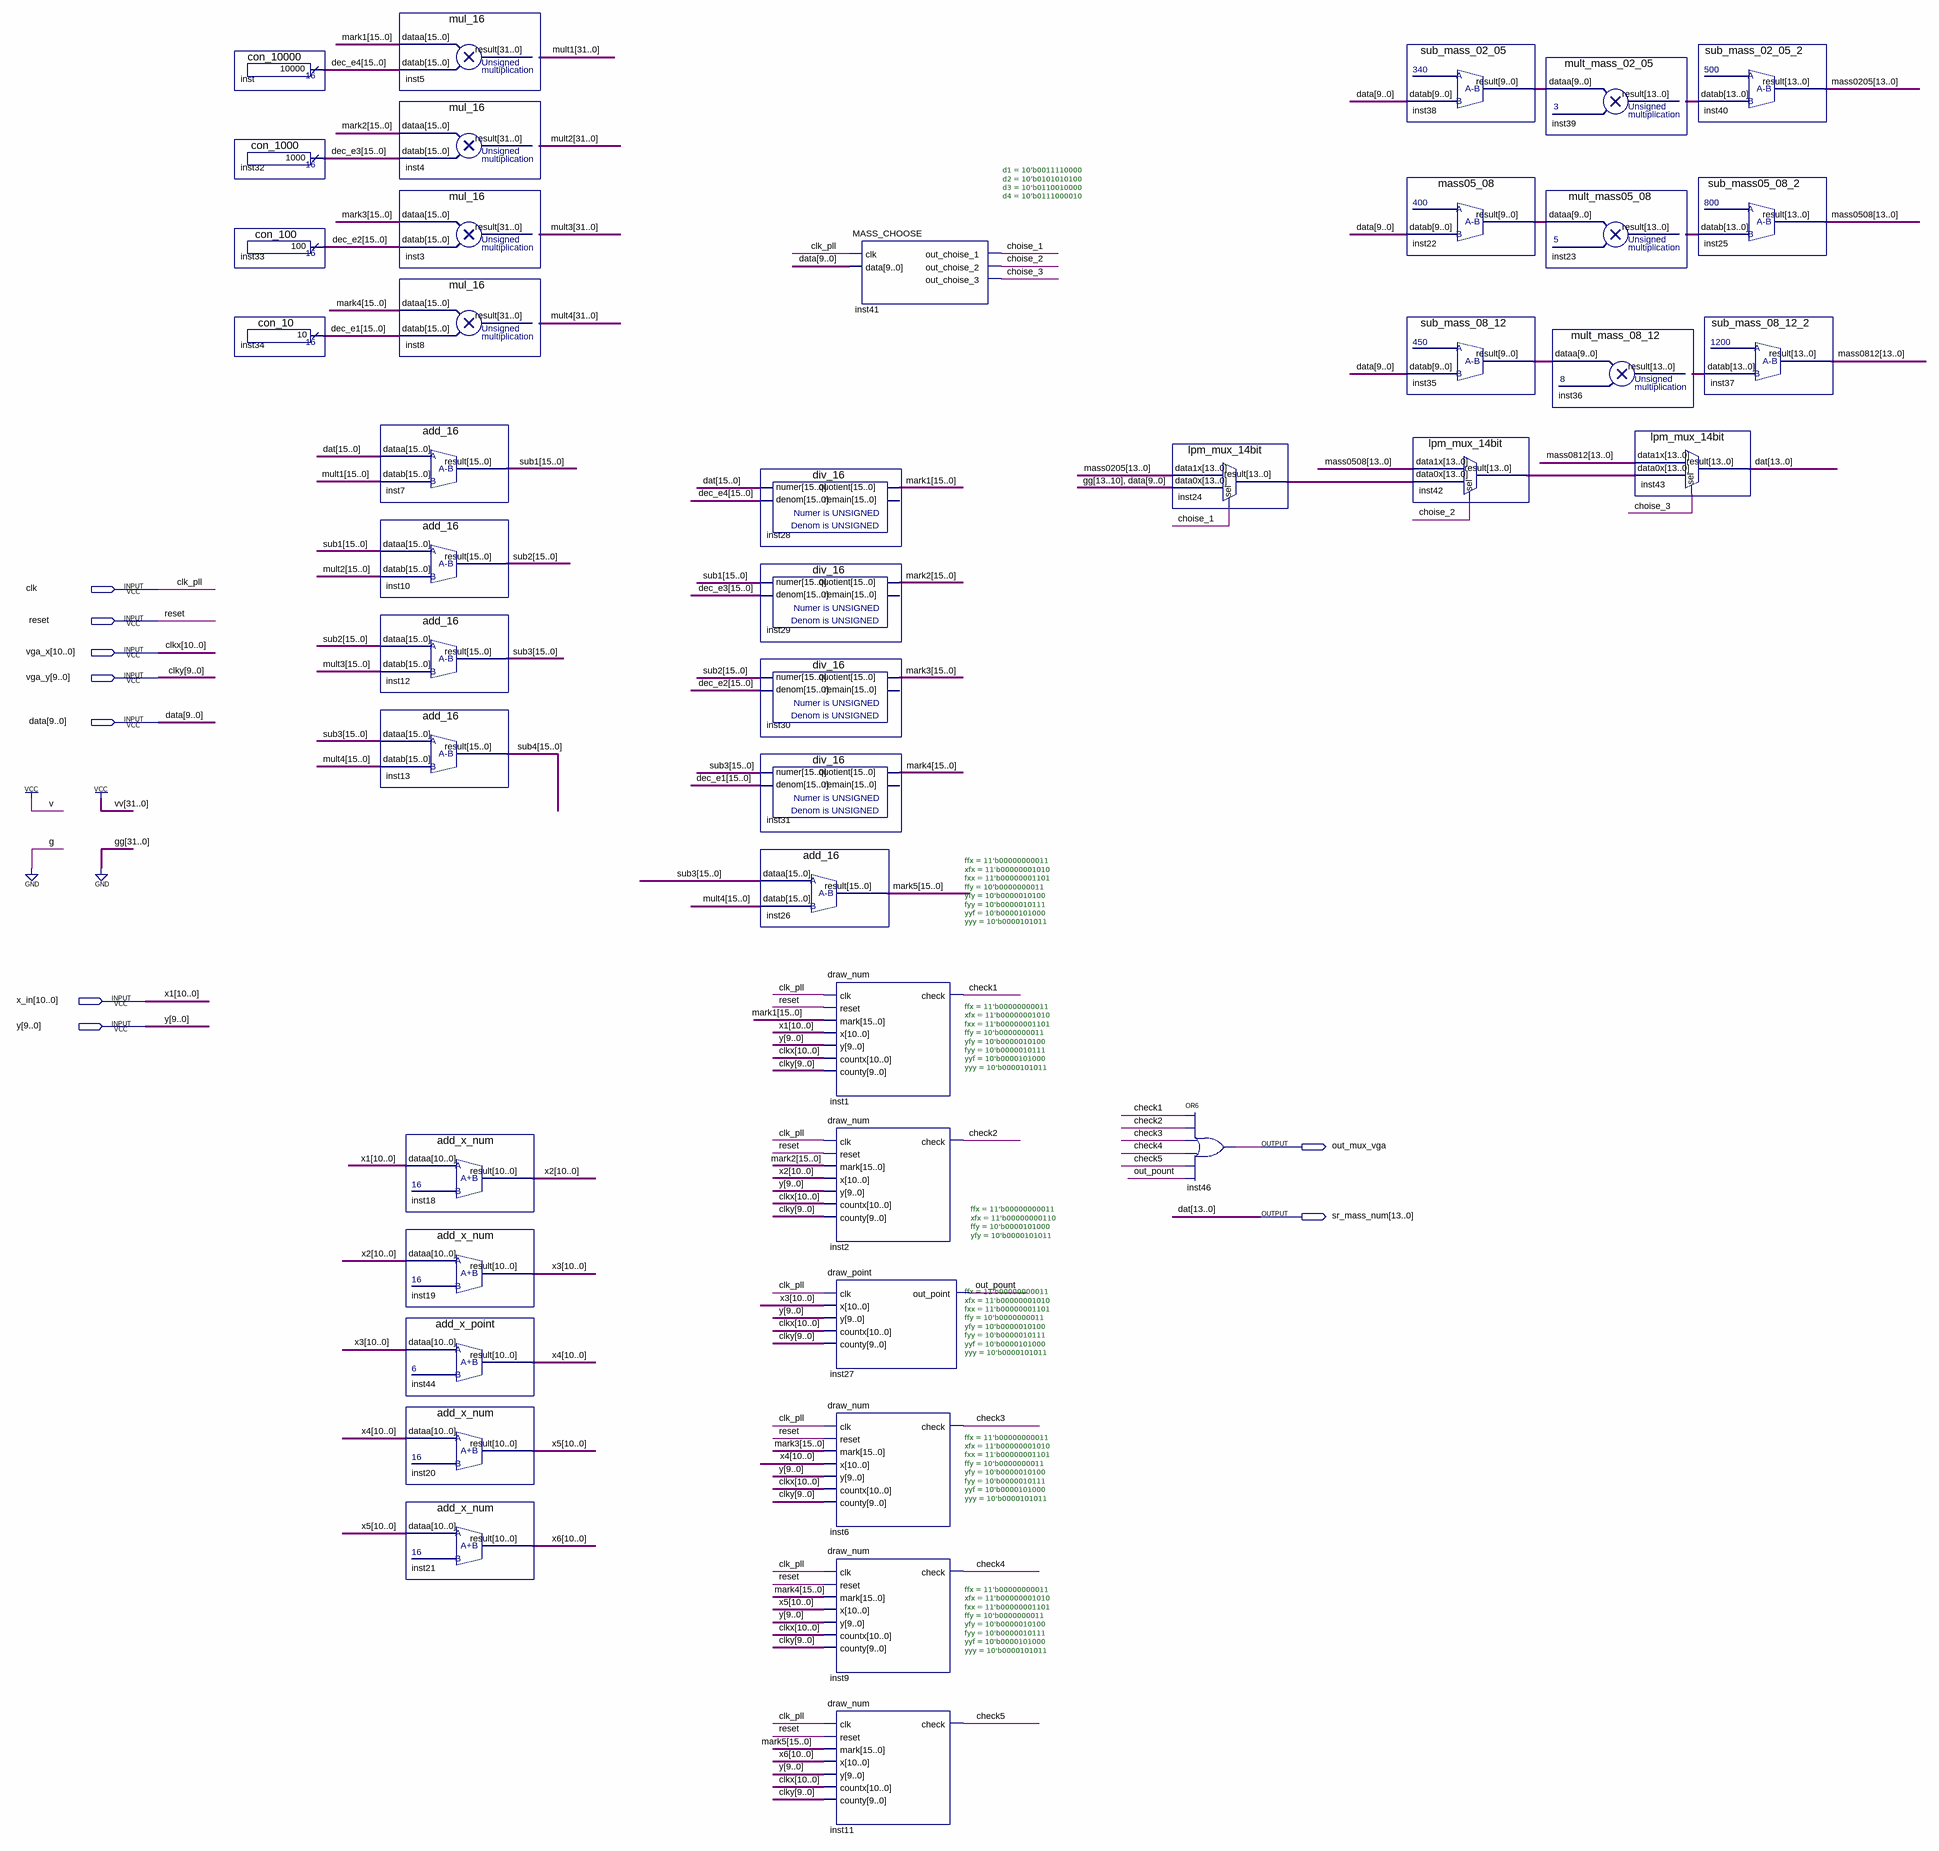
[diagram p0: schematic sheet]
// Quartus schematic sr_mass.bdf as structural Verilog: 42 symbols, 9 pins
module sr_mass (
  input  clk,
  input  reset,
  input  [10:0] vga_x,
  input  [9:0] vga_y,
  input  [9:0] data,
  input  [10:0] x_in,
  input  [9:0] y,
  output out_mux_vga,
  output [13:0] sr_mass_num
);

  wire check1, check2, check3, check4, check5, choise_1, choise_2, choise_3, out_pount;
  wire [9:0] inst22_result, inst35_result, inst38_result;
  wire [10:0] x2, x3, x4, x5, x6;
  wire [13:0] inst23_result, inst24_result, inst36_result, inst39_result, inst42_result, mass0205, mass0508,
       mass0812;
  wire [15:0] dec_e1, dec_e2, dec_e3, dec_e4, mark1, mark2, mark3, mark4, mark5, sub1, sub2, sub3, sub4;
  wire [15:14] dat;
  wire [31:0] mult1, mult2, mult3, mult4;

  con_10000 inst (.result(dec_e4));
  con_1000 inst32 (.result(dec_e3));
  con_100 inst33 (.result(dec_e2));
  con_10 inst34 (.result(dec_e1));
  mul_16 inst5 (.dataa(mark1), .datab(dec_e4), .result(mult1));
  mul_16 inst4 (.dataa(mark2), .datab(dec_e3), .result(mult2));
  mul_16 inst3 (.dataa(mark3), .datab(dec_e2), .result(mult3));
  mul_16 inst8 (.dataa(mark4), .datab(dec_e1), .result(mult4));
  add_16 inst7 (.dataa({dat, sr_mass_num}), .datab(mult1[15:0]), .result(sub1));
  add_16 inst10 (.dataa(sub1), .datab(mult2[15:0]), .result(sub2));
  add_16 inst12 (.dataa(sub2), .datab(mult3[15:0]), .result(sub3));
  add_16 inst13 (.dataa(sub3), .datab(mult4[15:0]), .result(sub4));
  add_x_num inst18 (.dataa(x_in), .result(x2));
  add_x_num inst19 (.dataa(x2), .result(x3));
  add_x_point inst44 (.dataa(x3), .result(x4));
  add_x_num inst20 (.dataa(x4), .result(x5));
  add_x_num inst21 (.dataa(x5), .result(x6));
  div_16 inst28 (.numer({dat, sr_mass_num}), .denom(dec_e4), .quotient(mark1));  // open: remain
  div_16 inst29 (.numer(sub1), .denom(dec_e3), .quotient(mark2));  // open: remain
  div_16 inst30 (.numer(sub2), .denom(dec_e2), .quotient(mark3));  // open: remain
  div_16 inst31 (.numer(sub3), .denom(dec_e1), .quotient(mark4));  // open: remain
  add_16 inst26 (.dataa(sub3), .datab(mult4[15:0]), .result(mark5));
  draw_num #(.ffx(11'b00000000011), .xfx(11'b00000001010), .fxx(11'b00000001101), .ffy(10'b0000000011), .yfy(10'b0000010100), .fyy(10'b0000010111), .yyf(10'b0000101000), .yyy(10'b0000101011)) inst1 (
    .clk(clk), .reset(reset), .mark(mark1), .x(x_in), .y(y), .countx(vga_x), .county(vga_y), .check(check1));
  draw_num #(.ffx(11'b00000000011), .xfx(11'b00000001010), .fxx(11'b00000001101), .ffy(10'b0000000011), .yfy(10'b0000010100), .fyy(10'b0000010111), .yyf(10'b0000101000), .yyy(10'b0000101011)) inst2 (
    .clk(clk), .reset(reset), .mark(mark2), .x(x2), .y(y), .countx(vga_x), .county(vga_y), .check(check2));
  draw_point #(.ffx(11'b00000000011), .xfx(11'b00000000110), .ffy(10'b0000101000), .yfy(10'b0000101011)) inst27 (
    .clk(clk), .x(x3), .y(y), .countx(vga_x), .county(vga_y), .out_point(out_pount));
  draw_num #(.ffx(11'b00000000011), .xfx(11'b00000001010), .fxx(11'b00000001101), .ffy(10'b0000000011), .yfy(10'b0000010100), .fyy(10'b0000010111), .yyf(10'b0000101000), .yyy(10'b0000101011)) inst6 (
    .clk(clk), .reset(reset), .mark(mark3), .x(x4), .y(y), .countx(vga_x), .county(vga_y), .check(check3));
  draw_num #(.ffx(11'b00000000011), .xfx(11'b00000001010), .fxx(11'b00000001101), .ffy(10'b0000000011), .yfy(10'b0000010100), .fyy(10'b0000010111), .yyf(10'b0000101000), .yyy(10'b0000101011)) inst9 (
    .clk(clk), .reset(reset), .mark(mark4), .x(x5), .y(y), .countx(vga_x), .county(vga_y), .check(check4));
  draw_num #(.ffx(11'b00000000011), .xfx(11'b00000001010), .fxx(11'b00000001101), .ffy(10'b0000000011), .yfy(10'b0000010100), .fyy(10'b0000010111), .yyf(10'b0000101000), .yyy(10'b0000101011)) inst11 (
    .clk(clk), .reset(reset), .mark(mark5), .x(x6), .y(y), .countx(vga_x), .county(vga_y), .check(check5));
  MASS_CHOOSE #(.d1(10'b0011110000), .d2(10'b0101010100), .d3(10'b0110010000), .d4(10'b0111000010)) inst41 (
    .clk(clk), .data(data), .out_choise_1(choise_1), .out_choise_2(choise_2), .out_choise_3(choise_3));
  lpm_mux_14bit inst24 (.data1x(mass0205), .data0x({4'b0000, data}), .sel(choise_1), .result(inst24_result));
  or inst46 (out_mux_vga, check1, check2, check3, check4, check5, out_pount);
  sub_mass_02_05 inst38 (.datab(data), .result(inst38_result));
  mass05_08 inst22 (.datab(data), .result(inst22_result));
  sub_mass_08_12 inst35 (.datab(data), .result(inst35_result));
  lpm_mux_14bit inst42 (.data1x(mass0508), .data0x(inst24_result), .sel(choise_2), .result(inst42_result));
  mult_mass_02_05 inst39 (.dataa(inst38_result), .result(inst39_result));
  mult_mass05_08 inst23 (.dataa(inst22_result), .result(inst23_result));
  mult_mass_08_12 inst36 (.dataa(inst35_result), .result(inst36_result));
  lpm_mux_14bit inst43 (.data1x(mass0812), .data0x(inst42_result), .sel(choise_3), .result(sr_mass_num));
  sub_mass_02_05_2 inst40 (.datab(inst39_result), .result(mass0205));
  sub_mass05_08_2 inst25 (.datab(inst23_result), .result(mass0508));
  sub_mass_08_12_2 inst37 (.datab(inst36_result), .result(mass0812));

  // Other names for the same wires on the sheet: clk_pll = clk; clkx[10:0] = vga_x; clky[9:0] = vga_y;
  //   dat[13:0] = sr_mass_num; x1[10:0] = x_in
endmodule
